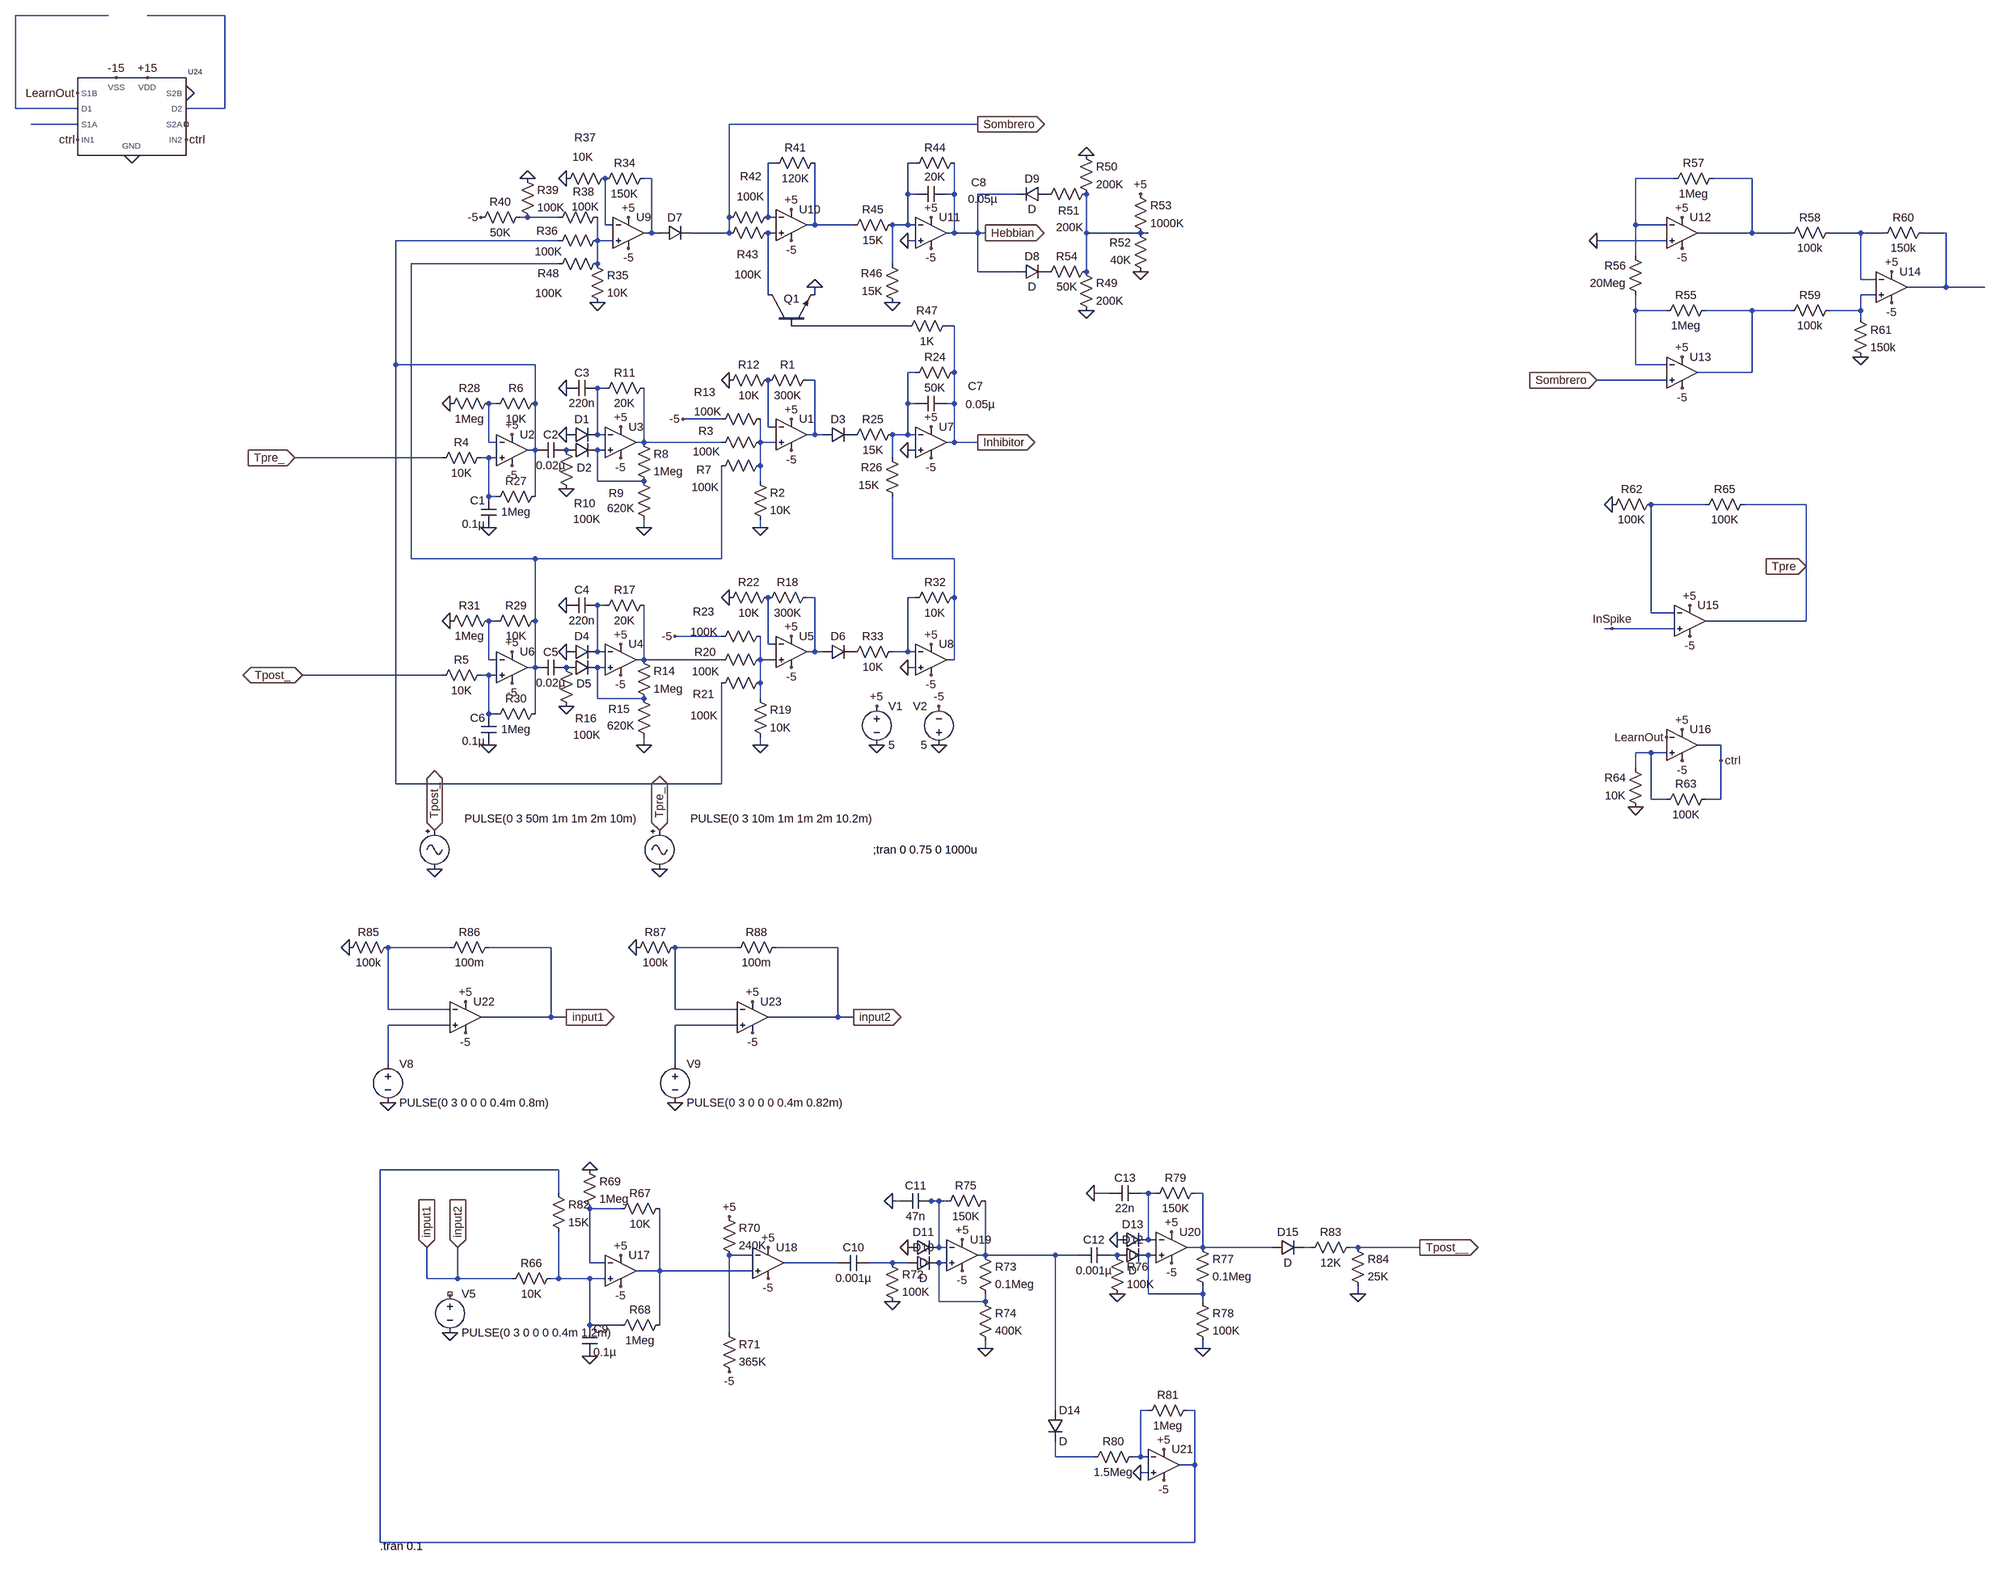
[diagram p0: schematic combined_schematicV3.asc]
combined_schematicV3.asc, the LTspice schematic file:
Version 4
SHEET 1 2820 2808
WIRE -1376 -544 -1568 -544
WIRE -1136 -544 -1296 -544
WIRE -1568 -352 -1568 -544
WIRE -1440 -352 -1568 -352
WIRE -1136 -352 -1136 -544
WIRE -1136 -352 -1216 -352
WIRE -1440 -320 -1536 -320
WIRE 416 -320 -96 -320
WIRE 0 -240 -16 -240
WIRE 288 -240 272 -240
WIRE -256 -208 -272 -208
WIRE 2176 -208 2096 -208
WIRE 2336 -208 2256 -208
WIRE 272 -176 272 -240
WIRE 288 -176 272 -176
WIRE 368 -176 368 -240
WIRE 368 -176 352 -176
WIRE 496 -176 416 -176
WIRE -512 -128 -528 -128
WIRE -448 -128 -512 -128
WIRE -96 -128 -96 -320
WIRE -16 -128 -16 -240
WIRE 0 -128 -16 -128
WIRE -352 -112 -352 -208
WIRE -336 -112 -352 -112
WIRE 80 -112 80 -240
WIRE 80 -112 64 -112
WIRE 160 -112 80 -112
WIRE 272 -112 272 -176
WIRE 272 -112 240 -112
WIRE 288 -112 272 -112
WIRE 2096 -112 2096 -208
WIRE 2160 -112 2096 -112
WIRE -256 -96 -256 -208
WIRE -256 -96 -272 -96
WIRE -240 -96 -256 -96
WIRE -96 -96 -96 -128
WIRE -96 -96 -176 -96
WIRE 0 -96 -16 -96
WIRE 368 -96 368 -176
WIRE 368 -96 352 -96
WIRE 416 -96 416 -176
WIRE 416 -96 368 -96
WIRE 432 -96 416 -96
WIRE 640 -96 640 -176
WIRE 752 -96 640 -96
WIRE 768 -96 752 -96
WIRE 2336 -96 2336 -208
WIRE 2336 -96 2224 -96
WIRE 2416 -96 2336 -96
WIRE 2560 -96 2496 -96
WIRE 2608 -96 2560 -96
WIRE 2736 -96 2688 -96
WIRE -448 -80 -784 -80
WIRE -368 -80 -368 -128
WIRE -336 -80 -368 -80
WIRE 288 -80 272 -80
WIRE 2160 -80 2016 -80
WIRE 2096 -48 2096 -112
WIRE -448 -32 -752 -32
WIRE -368 -32 -368 -80
WIRE 240 -32 240 -112
WIRE 416 -16 416 -96
WIRE 496 -16 416 -16
WIRE 640 -16 640 -96
WIRE 2560 0 2560 -96
WIRE 2592 0 2560 0
WIRE 2736 16 2736 -96
WIRE 2736 16 2656 16
WIRE 2816 16 2736 16
WIRE -16 32 -16 -96
WIRE 80 32 80 16
WIRE 2592 32 2560 32
WIRE 2096 64 2096 32
WIRE 2160 64 2096 64
WIRE 2336 64 2240 64
WIRE 2416 64 2336 64
WIRE 2560 64 2560 32
WIRE 2560 64 2496 64
WIRE 2560 80 2560 64
WIRE 272 96 32 96
WIRE 368 96 352 96
WIRE -784 176 -784 -80
WIRE -496 176 -784 176
WIRE 2096 176 2096 64
WIRE 2160 176 2096 176
WIRE 288 192 272 192
WIRE 368 192 368 96
WIRE 2336 192 2336 64
WIRE 2336 192 2224 192
WIRE 80 208 64 208
WIRE 2160 208 2016 208
WIRE -352 224 -368 224
WIRE -576 256 -592 256
WIRE -496 256 -496 176
WIRE 272 256 272 192
WIRE 288 256 272 256
WIRE 368 256 368 192
WIRE 368 256 352 256
WIRE -112 288 -192 288
WIRE -16 304 -16 208
WIRE 0 304 -16 304
WIRE -368 320 -368 224
WIRE -352 320 -368 320
WIRE 80 320 80 208
WIRE 80 320 64 320
WIRE 96 320 80 320
WIRE 272 320 272 256
WIRE 272 320 240 320
WIRE 288 320 272 320
WIRE -592 336 -592 256
WIRE -576 336 -592 336
WIRE -272 336 -272 224
WIRE -272 336 -288 336
WIRE -112 336 -272 336
WIRE -32 336 -32 288
WIRE 0 336 -32 336
WIRE 368 336 368 256
WIRE 368 336 352 336
WIRE 416 336 368 336
WIRE -496 352 -496 256
WIRE -496 352 -512 352
WIRE -352 352 -368 352
WIRE 288 352 272 352
WIRE -688 368 -992 368
WIRE -592 368 -608 368
WIRE -576 368 -592 368
WIRE 240 368 240 320
WIRE -32 384 -32 336
WIRE -368 416 -368 352
WIRE -272 416 -368 416
WIRE -32 416 -32 384
WIRE -592 448 -592 368
WIRE -576 448 -592 448
WIRE -496 448 -496 352
WIRE 2240 464 2128 464
WIRE 2448 464 2320 464
WIRE -272 512 -272 496
WIRE -32 512 -32 496
WIRE -752 576 -752 -32
WIRE -496 576 -752 576
WIRE -112 576 -112 384
WIRE -112 576 -496 576
WIRE 240 576 240 448
WIRE 368 576 240 576
WIRE 2448 592 2448 464
WIRE 80 656 64 656
WIRE 288 656 272 656
WIRE 368 656 368 576
WIRE -352 672 -368 672
WIRE 2128 688 2128 464
WIRE 2176 688 2128 688
WIRE -576 704 -592 704
WIRE -496 704 -496 576
WIRE 2448 704 2448 592
WIRE 2448 704 2240 704
WIRE 2048 720 2032 720
WIRE 2176 720 2048 720
WIRE -112 736 -208 736
WIRE -16 752 -16 656
WIRE 0 752 -16 752
WIRE -368 768 -368 672
WIRE -352 768 -368 768
WIRE 80 768 80 656
WIRE 80 768 64 768
WIRE 96 768 80 768
WIRE 272 768 272 656
WIRE 272 768 240 768
WIRE 288 768 272 768
WIRE -592 784 -592 704
WIRE -576 784 -592 784
WIRE -272 784 -272 672
WIRE -272 784 -288 784
WIRE -112 784 -272 784
WIRE -32 784 -32 736
WIRE 0 784 -32 784
WIRE 368 784 368 656
WIRE 368 784 352 784
WIRE -496 800 -496 704
WIRE -496 800 -512 800
WIRE -352 800 -368 800
WIRE 288 800 272 800
WIRE -688 816 -976 816
WIRE -592 816 -608 816
WIRE -576 816 -592 816
WIRE -32 832 -32 784
WIRE -368 864 -368 800
WIRE -272 864 -368 864
WIRE -32 864 -32 832
WIRE -592 896 -592 816
WIRE -576 896 -592 896
WIRE -496 896 -496 800
WIRE -272 960 -272 944
WIRE -32 960 -32 944
WIRE 2272 960 2224 960
WIRE 2128 976 2096 976
WIRE 2160 976 2128 976
WIRE 2272 992 2272 960
WIRE 2096 1008 2096 976
WIRE -784 1040 -784 176
WIRE -112 1040 -112 832
WIRE -112 1040 -784 1040
WIRE 2128 1072 2128 976
WIRE 2160 1072 2128 1072
WIRE 2272 1072 2272 992
WIRE 2272 1072 2240 1072
WIRE -672 1504 -800 1504
WIRE -464 1504 -592 1504
WIRE -80 1504 -208 1504
WIRE 128 1504 0 1504
WIRE -800 1632 -800 1504
WIRE -672 1632 -800 1632
WIRE -208 1632 -208 1504
WIRE -80 1632 -208 1632
WIRE -464 1648 -464 1504
WIRE -464 1648 -608 1648
WIRE -432 1648 -464 1648
WIRE 128 1648 128 1504
WIRE 128 1648 -16 1648
WIRE 160 1648 128 1648
WIRE -672 1664 -800 1664
WIRE -80 1664 -208 1664
WIRE -800 1744 -800 1664
WIRE -208 1744 -208 1664
WIRE -448 2016 -816 2016
WIRE -448 2064 -448 2016
WIRE 688 2064 656 2064
WIRE 768 2064 752 2064
WIRE 784 2064 768 2064
WIRE 880 2064 864 2064
WIRE 256 2080 240 2080
WIRE 320 2080 304 2080
WIRE 336 2080 320 2080
WIRE 352 2080 336 2080
WIRE -320 2096 -384 2096
WIRE 768 2160 768 2064
WIRE 784 2160 768 2160
WIRE 336 2176 336 2080
WIRE 352 2176 336 2176
WIRE 880 2176 880 2064
WIRE 880 2176 848 2176
WIRE 1024 2176 880 2176
WIRE 1104 2176 1088 2176
WIRE 1200 2176 1184 2176
WIRE 1328 2176 1200 2176
WIRE -48 2192 -96 2192
WIRE 432 2192 432 2080
WIRE 432 2192 416 2192
WIRE 576 2192 432 2192
WIRE 624 2192 576 2192
WIRE 704 2192 688 2192
WIRE 784 2192 768 2192
WIRE -384 2208 -384 2096
WIRE -352 2208 -384 2208
WIRE 128 2208 16 2208
WIRE 240 2208 192 2208
WIRE 272 2208 240 2208
WIRE 352 2208 336 2208
WIRE -240 2224 -240 2096
WIRE -240 2224 -288 2224
WIRE -48 2224 -240 2224
WIRE -720 2240 -720 2176
WIRE -656 2240 -656 2176
WIRE -656 2240 -720 2240
WIRE -544 2240 -656 2240
WIRE -448 2240 -448 2144
WIRE -448 2240 -464 2240
WIRE -384 2240 -448 2240
WIRE -352 2240 -384 2240
WIRE 768 2272 768 2192
WIRE 880 2272 880 2256
WIRE 880 2272 768 2272
WIRE 1200 2272 1200 2256
WIRE 336 2288 336 2208
WIRE 432 2288 432 2272
WIRE 432 2288 336 2288
WIRE 880 2288 880 2272
WIRE -384 2336 -384 2240
WIRE -320 2336 -384 2336
WIRE -240 2336 -240 2224
WIRE -96 2352 -96 2192
WIRE 432 2384 432 2368
WIRE 880 2384 880 2368
WIRE 576 2512 576 2192
WIRE 768 2512 752 2512
WIRE 864 2512 848 2512
WIRE 576 2608 576 2576
WIRE 656 2608 576 2608
WIRE 752 2608 752 2512
WIRE 752 2608 736 2608
WIRE 768 2608 752 2608
WIRE 864 2624 864 2512
WIRE 864 2624 832 2624
WIRE 768 2640 752 2640
WIRE -816 2784 -816 2016
WIRE 864 2784 864 2624
WIRE 864 2784 -816 2784
FLAG 32 288 +5
FLAG 32 352 -5
FLAG -240 1216 0
FLAG -704 1216 0
FLAG -544 320 +5
FLAG -544 384 -5
FLAG -320 304 +5
FLAG -320 368 -5
FLAG -432 320 0
FLAG -432 224 0
FLAG -432 432 0
FLAG -96 208 0
FLAG -192 288 -5
FLAG -320 752 +5
FLAG -320 816 -5
FLAG -432 768 0
FLAG -432 672 0
FLAG -432 880 0
FLAG -272 960 0
FLAG -272 512 0
FLAG 32 736 +5
FLAG 32 800 -5
FLAG -96 656 0
FLAG -208 736 -5
FLAG -592 512 0
FLAG -672 256 0
FLAG -544 768 +5
FLAG -544 832 -5
FLAG -592 960 0
FLAG -672 704 0
FLAG 320 304 +5
FLAG 320 368 -5
FLAG 320 752 +5
FLAG 320 816 -5
FLAG 272 800 0
FLAG 272 352 0
FLAG -32 512 0
FLAG -32 960 0
FLAG 416 336 Inhibitor
IOPIN 416 336 Out
FLAG -304 -128 +5
FLAG -304 -64 -5
FLAG -432 -208 0
FLAG -512 -208 0
FLAG 32 -144 +5
FLAG 32 -80 -5
FLAG -608 -128 -5
FLAG 320 -128 +5
FLAG 320 -64 -5
FLAG 272 -80 0
FLAG 240 48 0
FLAG 80 16 0
FLAG 416 -320 Sombrero
IOPIN 416 -320 Out
FLAG 208 960 0
FLAG 336 960 0
FLAG 336 880 -5
FLAG 208 880 +5
FLAG -976 816 Tpost_
IOPIN -976 816 BiDir
FLAG -704 1136 Tpost_
IOPIN -704 1136 BiDir
FLAG -240 1136 Tpre_
IOPIN -240 1136 BiDir
FLAG -368 48 0
FLAG -992 368 Tpre_
IOPIN -992 368 In
FLAG 432 -96 Hebbian
IOPIN 432 -96 Out
FLAG 752 -16 0
FLAG 752 -176 +5
FLAG 640 -256 0
FLAG 640 64 0
FLAG 2192 -128 +5
FLAG 2192 -64 -5
FLAG 2192 160 +5
FLAG 2192 224 -5
FLAG 2624 -16 +5
FLAG 2624 48 -5
FLAG 2560 160 0
FLAG 2016 208 Sombrero
IOPIN 2016 208 In
FLAG 2016 -80 0
FLAG 2208 672 +5
FLAG 2208 736 -5
FLAG 2048 720 InSpike
FLAG 2048 464 0
FLAG 2448 592 Tpre
IOPIN 2448 592 In
FLAG 2192 928 +5
FLAG 2160 944 LearnOut
FLAG 2096 1088 0
FLAG 2272 992 ctrl
FLAG 2192 992 -5
FLAG -1328 -256 0
FLAG -1296 -416 +15
FLAG -1360 -416 -15
FLAG -1216 -384 0
FLAG -1440 -384 LearnOut
FLAG -1440 -288 ctrl
FLAG -1216 -288 ctrl
FLAG -384 2016 0
FLAG -384 2400 0
FLAG 240 2288 0
FLAG 432 2384 0
FLAG 240 2080 0
FLAG 272 2176 0
FLAG 704 2272 0
FLAG 880 2384 0
FLAG 656 2064 0
FLAG 704 2160 0
FLAG 752 2640 0
FLAG -672 2352 0
FLAG -320 2192 +5
FLAG -16 2176 +5
FLAG 384 2160 +5
FLAG 816 2144 +5
FLAG 800 2592 +5
FLAG 1200 2272 0
FLAG 1328 2176 Tpost__
IOPIN 1328 2176 Out
FLAG -16 2240 -5
FLAG -320 2256 -5
FLAG 384 2224 -5
FLAG 816 2208 -5
FLAG 800 2656 -5
FLAG -96 2432 -5
FLAG -96 2112 +5
FLAG -880 1504 0
FLAG -800 1824 0
FLAG -640 1616 +5
FLAG -640 1680 -5
FLAG -288 1504 0
FLAG -208 1824 0
FLAG -48 1616 +5
FLAG -48 1680 -5
FLAG -432 1648 input1
IOPIN -432 1648 Out
FLAG 160 1648 input2
IOPIN 160 1648 Out
FLAG -720 2176 input1
IOPIN -720 2176 In
FLAG -656 2176 input2
IOPIN -656 2176 In
SYMBOL Opamps\\UniversalOpamp2 32 320 R0
SYMATTR InstName U1
SYMBOL res 80 192 R90
WINDOW 0 0 56 VBottom 2
WINDOW 3 32 56 VTop 2
SYMATTR InstName R1
SYMATTR Value 300K
SYMBOL res -48 400 R0
SYMATTR InstName R2
SYMATTR Value 10K
SYMBOL res -16 320 R90
WINDOW 0 8 128 VBottom 2
WINDOW 3 20 127 VTop 2
SYMATTR InstName R3
SYMATTR Value 100K
SYMBOL Opamps\\UniversalOpamp2 -544 352 R0
SYMATTR InstName U2
SYMBOL cap -576 512 R180
WINDOW 0 24 56 Left 2
WINDOW 3 24 8 Left 2
SYMATTR InstName C1
SYMATTR Value 0.1µ
SYMBOL res -592 352 R90
WINDOW 0 0 56 VBottom 2
WINDOW 3 32 56 VTop 2
SYMATTR InstName R4
SYMATTR Value 10K
SYMBOL res -592 800 R90
WINDOW 0 0 56 VBottom 2
WINDOW 3 32 56 VTop 2
SYMATTR InstName R5
SYMATTR Value 10K
SYMBOL res -480 240 R90
WINDOW 0 0 56 VBottom 2
WINDOW 3 32 56 VTop 2
SYMATTR InstName R6
SYMATTR Value 10K
SYMBOL res -16 368 R90
WINDOW 0 40 132 VBottom 2
WINDOW 3 45 130 VTop 2
SYMATTR InstName R7
SYMATTR Value 100K
SYMBOL Opamps\\UniversalOpamp2 -320 336 R0
SYMATTR InstName U3
SYMBOL diode -432 336 R270
WINDOW 0 32 32 VTop 2
WINDOW 3 0 32 Invisible 2
SYMATTR InstName D1
SYMBOL diode -432 368 R270
WINDOW 0 -36 37 VTop 2
WINDOW 3 0 32 Invisible 2
SYMATTR InstName D2
SYMBOL res -288 320 R0
SYMATTR InstName R8
SYMATTR Value 1Meg
SYMBOL res -256 512 R180
WINDOW 0 58 71 Left 2
WINDOW 3 36 40 Left 2
SYMATTR InstName R9
SYMATTR Value 620K
SYMBOL res -448 336 R0
WINDOW 0 32 126 Left 2
WINDOW 3 30 158 Left 2
SYMATTR InstName R10
SYMATTR Value 100K
SYMBOL cap -432 336 R90
WINDOW 0 0 32 VBottom 2
WINDOW 3 32 32 VTop 2
SYMATTR InstName C2
SYMATTR Value 0.02µ
SYMBOL res -256 208 R90
WINDOW 0 0 56 VBottom 2
WINDOW 3 32 56 VTop 2
SYMATTR InstName R11
SYMATTR Value 20K
SYMBOL cap -368 208 R90
WINDOW 0 0 32 VBottom 2
WINDOW 3 32 32 VTop 2
SYMATTR InstName C3
SYMATTR Value 220n
SYMBOL res -112 224 R270
WINDOW 0 32 56 VTop 2
WINDOW 3 0 56 VBottom 2
SYMATTR InstName R12
SYMATTR Value 10K
SYMBOL diode 96 336 R270
WINDOW 0 32 32 VTop 2
WINDOW 3 0 32 Invisible 2
SYMATTR InstName D3
SYMBOL res -16 272 R90
WINDOW 0 -24 131 VBottom 2
WINDOW 3 -15 125 VTop 2
SYMATTR InstName R13
SYMATTR Value 100K
SYMBOL Opamps\\UniversalOpamp2 -320 784 R0
SYMATTR InstName U4
SYMBOL diode -432 784 R270
WINDOW 0 32 32 VTop 2
WINDOW 3 0 32 Invisible 2
SYMATTR InstName D4
SYMBOL diode -432 816 R270
WINDOW 0 -33 36 VTop 2
WINDOW 3 0 32 Invisible 2
SYMATTR InstName D5
SYMBOL res -288 768 R0
SYMATTR InstName R14
SYMATTR Value 1Meg
SYMBOL res -256 960 R180
WINDOW 0 45 74 Left 2
WINDOW 3 36 40 Left 2
SYMATTR InstName R15
SYMATTR Value 620K
SYMBOL res -448 784 R0
WINDOW 0 34 121 Left 2
WINDOW 3 30 155 Left 2
SYMATTR InstName R16
SYMATTR Value 100K
SYMBOL res -256 656 R90
WINDOW 0 0 56 VBottom 2
WINDOW 3 32 56 VTop 2
SYMATTR InstName R17
SYMATTR Value 20K
SYMBOL cap -368 656 R90
WINDOW 0 0 32 VBottom 2
WINDOW 3 32 32 VTop 2
SYMATTR InstName C4
SYMATTR Value 220n
SYMBOL cap -432 784 R90
WINDOW 0 0 32 VBottom 2
WINDOW 3 32 32 VTop 2
SYMATTR InstName C5
SYMATTR Value 0.02µ
SYMBOL Opamps\\UniversalOpamp2 32 768 R0
SYMATTR InstName U5
SYMBOL res 80 640 R90
WINDOW 0 0 56 VBottom 2
WINDOW 3 32 56 VTop 2
SYMATTR InstName R18
SYMATTR Value 300K
SYMBOL res -48 848 R0
SYMATTR InstName R19
SYMATTR Value 10K
SYMBOL res -16 768 R90
WINDOW 0 16 130 VBottom 2
WINDOW 3 25 129 VTop 2
SYMATTR InstName R20
SYMATTR Value 100K
SYMBOL res -16 816 R90
WINDOW 0 55 133 VBottom 2
WINDOW 3 68 132 VTop 2
SYMATTR InstName R21
SYMATTR Value 100K
SYMBOL res -112 672 R270
WINDOW 0 32 56 VTop 2
WINDOW 3 0 56 VBottom 2
SYMATTR InstName R22
SYMATTR Value 10K
SYMBOL diode 96 784 R270
WINDOW 0 32 32 VTop 2
WINDOW 3 0 32 Invisible 2
SYMATTR InstName D6
SYMBOL res -16 720 R90
WINDOW 0 -19 133 VBottom 2
WINDOW 3 -9 132 VTop 2
SYMATTR InstName R23
SYMATTR Value 100K
SYMBOL res 384 176 R90
WINDOW 0 0 56 VBottom 2
WINDOW 3 32 56 VTop 2
SYMATTR InstName R24
SYMATTR Value 50K
SYMBOL res 256 304 R90
WINDOW 0 0 56 VBottom 2
WINDOW 3 32 56 VTop 2
SYMATTR InstName R25
SYMATTR Value 15K
SYMBOL res 256 464 R180
WINDOW 0 36 76 Left 2
WINDOW 3 43 40 Left 2
SYMATTR InstName R26
SYMATTR Value 15K
SYMBOL res -480 432 R90
WINDOW 0 0 56 VBottom 2
WINDOW 3 32 56 VTop 2
SYMATTR InstName R27
SYMATTR Value 1Meg
SYMBOL res -576 240 R90
WINDOW 0 0 56 VBottom 2
WINDOW 3 32 56 VTop 2
SYMATTR InstName R28
SYMATTR Value 1Meg
SYMBOL Opamps\\UniversalOpamp2 -544 800 R0
SYMATTR InstName U6
SYMBOL cap -576 960 R180
WINDOW 0 24 56 Left 2
WINDOW 3 24 8 Left 2
SYMATTR InstName C6
SYMATTR Value 0.1µ
SYMBOL res -480 688 R90
WINDOW 0 0 56 VBottom 2
WINDOW 3 32 56 VTop 2
SYMATTR InstName R29
SYMATTR Value 10K
SYMBOL res -480 880 R90
WINDOW 0 0 56 VBottom 2
WINDOW 3 32 56 VTop 2
SYMATTR InstName R30
SYMATTR Value 1Meg
SYMBOL res -576 688 R90
WINDOW 0 0 56 VBottom 2
WINDOW 3 32 56 VTop 2
SYMATTR InstName R31
SYMATTR Value 1Meg
SYMBOL Opamps\\UniversalOpamp2 320 336 R0
SYMATTR InstName U7
SYMBOL res 384 640 R90
WINDOW 0 0 56 VBottom 2
WINDOW 3 32 56 VTop 2
SYMATTR InstName R32
SYMATTR Value 10K
SYMBOL Opamps\\UniversalOpamp2 320 784 R0
SYMATTR InstName U8
SYMBOL res 256 752 R90
WINDOW 0 0 56 VBottom 2
WINDOW 3 32 56 VTop 2
SYMATTR InstName R33
SYMATTR Value 10K
SYMBOL cap 352 240 R90
WINDOW 0 -4 -60 VBottom 2
WINDOW 3 2 -70 VTop 2
SYMATTR InstName C7
SYMATTR Value 0.05µ
SYMBOL Opamps\\UniversalOpamp2 -304 -96 R0
SYMATTR InstName U9
SYMBOL res -256 -224 R90
WINDOW 0 0 56 VBottom 2
WINDOW 3 32 56 VTop 2
SYMATTR InstName R34
SYMATTR Value 150K
SYMBOL res -384 -48 R0
SYMATTR InstName R35
SYMATTR Value 10K
SYMBOL res -352 -96 R90
WINDOW 0 12 120 VBottom 2
WINDOW 3 23 117 VTop 2
SYMATTR InstName R36
SYMATTR Value 100K
SYMBOL res -448 -192 R270
WINDOW 0 85 55 VTop 2
WINDOW 3 76 50 VBottom 2
SYMATTR InstName R37
SYMATTR Value 10K
SYMBOL res -352 -144 R90
WINDOW 0 -21 45 VBottom 2
WINDOW 3 -21 41 VTop 2
SYMATTR InstName R38
SYMATTR Value 100K
SYMBOL res -528 -224 R0
SYMATTR InstName R39
SYMATTR Value 100K
SYMBOL res -512 -144 R90
WINDOW 0 0 56 VBottom 2
WINDOW 3 32 56 VTop 2
SYMATTR InstName R40
SYMATTR Value 50K
SYMBOL diode -240 -80 R270
WINDOW 0 32 32 VTop 2
WINDOW 3 0 32 Invisible 2
SYMATTR InstName D7
SYMBOL res 96 -256 R90
WINDOW 0 0 56 VBottom 2
WINDOW 3 32 56 VTop 2
SYMATTR InstName R41
SYMATTR Value 120K
SYMBOL Opamps\\UniversalOpamp2 32 -112 R0
SYMATTR InstName U10
SYMBOL res 0 -144 R90
WINDOW 0 -53 52 VBottom 2
WINDOW 3 -42 52 VTop 2
SYMATTR InstName R42
SYMATTR Value 100K
SYMBOL res 0 -112 R90
WINDOW 0 76 58 VBottom 2
WINDOW 3 87 57 VTop 2
SYMATTR InstName R43
SYMATTR Value 100K
SYMBOL npn -16 96 R270
WINDOW 0 56 32 VRight 2
WINDOW 3 56 68 Invisible 2
SYMATTR InstName Q1
SYMBOL res 384 -256 R90
WINDOW 0 0 56 VBottom 2
WINDOW 3 60 56 VBottom 2
SYMATTR InstName R44
SYMATTR Value 20K
SYMBOL res 256 -128 R90
WINDOW 0 0 56 VBottom 2
WINDOW 3 32 56 VTop 2
SYMATTR InstName R45
SYMATTR Value 15K
SYMBOL res 256 64 R180
WINDOW 0 36 76 Left 2
WINDOW 3 36 40 Left 2
SYMATTR InstName R46
SYMATTR Value 15K
SYMBOL Opamps\\UniversalOpamp2 320 -96 R0
SYMATTR InstName U11
SYMBOL cap 352 -192 R90
WINDOW 0 8 -66 VBottom 2
WINDOW 3 11 -75 VTop 2
SYMATTR InstName C8
SYMATTR Value 0.05µ
SYMBOL res 256 112 R270
WINDOW 0 32 56 VTop 2
WINDOW 3 0 56 VBottom 2
SYMATTR InstName R47
SYMATTR Value 1K
SYMBOL voltage 208 864 R0
WINDOW 123 0 0 Left 2
WINDOW 39 0 0 Left 2
SYMATTR InstName V1
SYMATTR Value 5
SYMBOL voltage 336 976 R180
WINDOW 0 24 96 Left 2
WINDOW 3 24 16 Left 2
WINDOW 123 0 0 Left 2
WINDOW 39 0 0 Left 2
SYMATTR InstName V2
SYMATTR Value 5
SYMBOL Misc\\signal -704 1120 R0
WINDOW 0 24 16 Invisible 2
WINDOW 3 62 -8 Left 2
WINDOW 123 0 0 Left 2
WINDOW 39 0 0 Left 2
SYMATTR InstName V3
SYMATTR Value PULSE(0 3 50m 1m 1m 2m 10m)
SYMBOL Misc\\signal -240 1120 R0
WINDOW 0 24 16 Invisible 2
WINDOW 3 64 -8 Left 2
WINDOW 123 0 0 Left 2
WINDOW 39 0 0 Left 2
SYMATTR InstName V4
SYMATTR Value PULSE(0 3 10m 1m 1m 2m 10.2m)
SYMBOL res -352 -48 R90
WINDOW 0 51 117 VBottom 2
WINDOW 3 61 116 VTop 2
SYMATTR InstName R48
SYMATTR Value 100K
SYMBOL diode 496 0 R270
WINDOW 0 32 32 VTop 2
WINDOW 3 0 32 VBottom 2
SYMATTR InstName D8
SYMBOL diode 560 -192 R90
WINDOW 0 0 32 VBottom 2
WINDOW 3 32 32 VTop 2
SYMATTR InstName D9
SYMBOL res 624 -32 R0
SYMATTR InstName R49
SYMATTR Value 200K
SYMBOL res 624 -272 R0
SYMATTR InstName R50
SYMATTR Value 200K
SYMBOL res 656 -192 R90
WINDOW 0 66 52 VBottom 2
WINDOW 3 69 50 VTop 2
SYMATTR InstName R51
SYMATTR Value 200K
SYMBOL res 768 0 R180
WINDOW 0 36 76 Left 2
WINDOW 3 36 40 Left 2
SYMATTR InstName R52
SYMATTR Value 40K
SYMBOL res 736 -192 R0
SYMATTR InstName R53
SYMATTR Value 1000K
SYMBOL res 656 -32 R90
WINDOW 0 0 56 VBottom 2
WINDOW 3 32 56 VTop 2
SYMATTR InstName R54
SYMATTR Value 50K
SYMBOL Opamps\\UniversalOpamp2 2192 -96 R0
SYMATTR InstName U12
SYMBOL Opamps\\UniversalOpamp2 2192 192 R0
SYMATTR InstName U13
SYMBOL res 2256 48 R90
WINDOW 0 0 56 VBottom 2
WINDOW 3 32 56 VTop 2
SYMATTR InstName R55
SYMATTR Value 1Meg
SYMBOL res 2112 48 R180
WINDOW 0 36 76 Left 2
WINDOW 3 36 40 Left 2
SYMATTR InstName R56
SYMATTR Value 20Meg
SYMBOL res 2160 -192 R270
WINDOW 0 32 56 VTop 2
WINDOW 3 0 56 VBottom 2
SYMATTR InstName R57
SYMATTR Value 1Meg
SYMBOL res 2512 -112 R90
WINDOW 0 0 56 VBottom 2
WINDOW 3 32 56 VTop 2
SYMATTR InstName R58
SYMATTR Value 100k
SYMBOL res 2512 48 R90
WINDOW 0 0 56 VBottom 2
WINDOW 3 32 56 VTop 2
SYMATTR InstName R59
SYMATTR Value 100k
SYMBOL Opamps\\UniversalOpamp2 2624 16 R0
SYMATTR InstName U14
SYMBOL res 2704 -112 R90
WINDOW 0 0 56 VBottom 2
WINDOW 3 32 56 VTop 2
SYMATTR InstName R60
SYMATTR Value 150k
SYMBOL res 2544 64 R0
SYMATTR InstName R61
SYMATTR Value 150k
SYMBOL Opamps\\UniversalOpamp2 2208 704 R0
SYMATTR InstName U15
SYMBOL res 2144 448 R90
WINDOW 0 0 56 VBottom 2
WINDOW 3 32 56 VTop 2
SYMATTR InstName R62
SYMATTR Value 100K
SYMBOL Opamps\\UniversalOpamp2 2192 960 R0
SYMATTR InstName U16
SYMBOL res 2256 1056 R90
WINDOW 0 0 56 VBottom 2
WINDOW 3 32 56 VTop 2
SYMATTR InstName R63
SYMATTR Value 100K
SYMBOL res 2112 1104 R180
WINDOW 0 36 76 Left 2
WINDOW 3 36 40 Left 2
SYMATTR InstName R64
SYMATTR Value 10K
SYMBOL res 2336 448 R90
WINDOW 0 0 56 VBottom 2
WINDOW 3 32 56 VTop 2
SYMATTR InstName R65
SYMATTR Value 100K
SYMBOL voltage -672 2256 R0
WINDOW 123 0 0 Left 0
WINDOW 39 0 0 Left 0
SYMATTR InstName V5
SYMATTR Value PULSE(0 3 0 0 0 0.4m 1.2m)
SYMBOL res -448 2224 R90
WINDOW 0 0 56 VBottom 2
WINDOW 3 32 56 VTop 2
SYMATTR InstName R66
SYMATTR Value 10K
SYMBOL Opamps\\UniversalOpamp2 -320 2224 R0
SYMATTR InstName U17
SYMBOL res -224 2080 R90
WINDOW 0 0 56 VBottom 2
WINDOW 3 32 56 VTop 2
SYMATTR InstName R67
SYMATTR Value 10K
SYMBOL res -224 2320 R90
WINDOW 0 0 56 VBottom 2
WINDOW 3 32 56 VTop 2
SYMATTR InstName R68
SYMATTR Value 1Meg
SYMBOL res -400 2000 R0
SYMATTR InstName R69
SYMATTR Value 1Meg
SYMBOL cap -400 2336 R0
SYMATTR InstName C9
SYMATTR Value 0.1µ
SYMBOL Opamps\\UniversalOpamp2 -16 2208 R0
SYMATTR InstName U18
SYMBOL res -112 2096 R0
SYMATTR InstName R70
SYMATTR Value 240K
SYMBOL res -112 2336 R0
SYMATTR InstName R71
SYMATTR Value 365K
SYMBOL cap 192 2192 R90
WINDOW 0 0 32 VBottom 2
WINDOW 3 32 32 VTop 2
SYMATTR InstName C10
SYMATTR Value 0.001µ
SYMBOL res 224 2192 R0
SYMATTR InstName R72
SYMATTR Value 100K
SYMBOL diode 272 2224 R270
WINDOW 0 32 32 VTop 2
WINDOW 3 0 32 VBottom 2
SYMATTR InstName D10
SYMBOL Opamps\\UniversalOpamp2 384 2192 R0
SYMATTR InstName U19
SYMBOL res 416 2176 R0
SYMATTR InstName R73
SYMATTR Value 0.1Meg
SYMBOL res 416 2272 R0
SYMATTR InstName R74
SYMATTR Value 400K
SYMBOL res 448 2064 R90
WINDOW 0 0 56 VBottom 2
WINDOW 3 32 56 VTop 2
SYMATTR InstName R75
SYMATTR Value 150K
SYMBOL cap 320 2064 R90
WINDOW 0 0 32 VBottom 2
WINDOW 3 32 32 VTop 2
SYMATTR InstName C11
SYMATTR Value 47n
SYMBOL diode 272 2192 R270
WINDOW 0 32 32 VTop 2
WINDOW 3 0 32 VBottom 2
SYMATTR InstName D11
SYMBOL cap 688 2176 R90
WINDOW 0 0 32 VBottom 2
WINDOW 3 32 32 VTop 2
SYMATTR InstName C12
SYMATTR Value 0.001µ
SYMBOL diode 704 2208 R270
WINDOW 0 32 32 VTop 2
WINDOW 3 0 32 VBottom 2
SYMATTR InstName D12
SYMBOL res 688 2176 R0
SYMATTR InstName R76
SYMATTR Value 100K
SYMBOL Opamps\\UniversalOpamp2 816 2176 R0
SYMATTR InstName U20
SYMBOL res 864 2160 R0
SYMATTR InstName R77
SYMATTR Value 0.1Meg
SYMBOL res 864 2272 R0
SYMATTR InstName R78
SYMATTR Value 100K
SYMBOL res 880 2048 R90
WINDOW 0 0 56 VBottom 2
WINDOW 3 32 56 VTop 2
SYMATTR InstName R79
SYMATTR Value 150K
SYMBOL cap 752 2048 R90
WINDOW 0 0 32 VBottom 2
WINDOW 3 32 32 VTop 2
SYMATTR InstName C13
SYMATTR Value 22n
SYMBOL diode 704 2176 R270
WINDOW 0 32 32 VTop 2
WINDOW 3 0 32 VBottom 2
SYMATTR InstName D13
SYMBOL diode 560 2512 R0
SYMATTR InstName D14
SYMBOL res 752 2592 R90
WINDOW 0 0 56 VBottom 2
WINDOW 3 32 56 VTop 2
SYMATTR InstName R80
SYMATTR Value 1.5Meg
SYMBOL Opamps\\UniversalOpamp2 800 2624 R0
SYMATTR InstName U21
SYMBOL res 864 2496 R90
WINDOW 0 0 56 VBottom 2
WINDOW 3 32 56 VTop 2
SYMATTR InstName R81
SYMATTR Value 1Meg
SYMBOL res -464 2048 R0
SYMATTR InstName R82
SYMATTR Value 15K
SYMBOL diode 1024 2192 R270
WINDOW 0 32 32 VTop 2
WINDOW 3 0 32 VBottom 2
SYMATTR InstName D15
SYMBOL res 1200 2160 R90
WINDOW 0 0 56 VBottom 2
WINDOW 3 32 56 VTop 2
SYMATTR InstName R83
SYMATTR Value 12K
SYMBOL res 1184 2160 R0
SYMATTR InstName R84
SYMATTR Value 25K
SYMBOL voltage -800 1728 R0
WINDOW 123 0 0 Left 0
WINDOW 39 0 0 Left 0
SYMATTR InstName V8
SYMATTR Value PULSE(0 3 0 0 0 0.4m 0.8m)
SYMBOL Opamps\\UniversalOpamp2 -640 1648 R0
SYMATTR InstName U22
SYMBOL res -784 1488 R90
WINDOW 0 0 56 VBottom 2
WINDOW 3 32 56 VTop 2
SYMATTR InstName R85
SYMATTR Value 100k
SYMBOL res -576 1488 R90
WINDOW 0 0 56 VBottom 2
WINDOW 3 32 56 VTop 2
SYMATTR InstName R86
SYMATTR Value 100m
SYMBOL voltage -208 1728 R0
WINDOW 123 0 0 Left 0
WINDOW 39 0 0 Left 0
SYMATTR InstName V9
SYMATTR Value PULSE(0 3 0 0 0 0.4m 0.82m)
SYMBOL Opamps\\UniversalOpamp2 -48 1648 R0
SYMATTR InstName U23
SYMBOL res -192 1488 R90
WINDOW 0 0 56 VBottom 2
WINDOW 3 32 56 VTop 2
SYMATTR InstName R87
SYMATTR Value 100k
SYMBOL res 16 1488 R90
WINDOW 0 0 56 VBottom 2
WINDOW 3 32 56 VTop 2
SYMATTR InstName R88
SYMATTR Value 100m
SYMBOL ADG1236 -1328 -336 R0
SYMATTR InstName U24
TEXT 200 1176 Left 2 !;tran 0 0.75 0 1000u
TEXT -816 2792 Left 2 !.tran 0.1

The netlist it stands for:
* combined_schematicV3.asc
XU1 N029 N027 +5 -5 N024 level.2 Avol=1Meg GBW=10Meg Slew=10Meg ilimit=25m rail=0 Vos=0 phimargin=45 en=0 enk=0 in=0 ink=0 Rin=500Meg  ; pins IN+ IN- V+ V- OUT
R1 N024 N027 300K
R2 N029 0 10K
R3 N029 N028 100K
XU2 N031 N026 +5 -5 N016 level.2 Avol=1Meg GBW=10Meg Slew=10Meg ilimit=25m rail=0 Vos=0 phimargin=45 en=0 enk=0 in=0 ink=0 Rin=500Meg  ; pins IN+ IN- V+ V- OUT
C1 0 N031 0.1µ
R4 N031 Tpre_ 10K
R5 N042 Tpost_ 10K
R6 N016 N026 10K
R7 N029 N018 100K
XU3 N030 N025 +5 -5 N028 level.2 Avol=1Meg GBW=10Meg Slew=10Meg ilimit=25m rail=0 Vos=0 phimargin=45 en=0 enk=0 in=0 ink=0 Rin=500Meg  ; pins IN+ IN- V+ V- OUT
D1 0 N025 D
D2 P001 N030 D
R8 N028 N030 1Meg
R9 0 N030 620K
R10 P001 0 100K
C2 P001 N016 0.02µ
R11 N028 N025 20K
C3 N025 0 220n
R12 0 N027 10K
D3 N024 P002 D
R13 N029 -5 100K
XU4 N041 N036 +5 -5 N039 level.2 Avol=1Meg GBW=10Meg Slew=10Meg ilimit=25m rail=0 Vos=0 phimargin=45 en=0 enk=0 in=0 ink=0 Rin=500Meg  ; pins IN+ IN- V+ V- OUT
D4 0 N036 D
D5 P003 N041 D
R14 N039 N041 1Meg
R15 0 N041 620K
R16 P003 0 100K
R17 N039 N036 20K
C4 N036 0 220n
C5 P003 N018 0.02µ
XU5 N040 N038 +5 -5 N034 level.2 Avol=1Meg GBW=10Meg Slew=10Meg ilimit=25m rail=0 Vos=0 phimargin=45 en=0 enk=0 in=0 ink=0 Rin=500Meg  ; pins IN+ IN- V+ V- OUT
R18 N034 N038 300K
R19 N040 0 10K
R20 N040 N039 100K
R21 N040 N016 100K
R22 0 N038 10K
D6 N034 P004 D
R23 N040 -5 100K
R24 Inhibitor N023 50K
R25 N023 P002 15K
R26 N033 N023 15K
R27 N016 N031 1Meg
R28 N026 0 1Meg
XU6 N042 N037 +5 -5 N018 level.2 Avol=1Meg GBW=10Meg Slew=10Meg ilimit=25m rail=0 Vos=0 phimargin=45 en=0 enk=0 in=0 ink=0 Rin=500Meg  ; pins IN+ IN- V+ V- OUT
C6 0 N042 0.1µ
R29 N018 N037 10K
R30 N018 N042 1Meg
R31 N037 0 1Meg
XU7 0 N023 +5 -5 Inhibitor level.2 Avol=1Meg GBW=10Meg Slew=10Meg ilimit=25m rail=0 Vos=0 phimargin=45 en=0 enk=0 in=0 ink=0 Rin=500Meg  ; pins IN+ IN- V+ V- OUT
R32 N033 N035 10K
XU8 0 N035 +5 -5 N033 level.2 Avol=1Meg GBW=10Meg Slew=10Meg ilimit=25m rail=0 Vos=0 phimargin=45 en=0 enk=0 in=0 ink=0 Rin=500Meg  ; pins IN+ IN- V+ V- OUT
R33 N035 P004 10K
C7 Inhibitor N023 0.05µ
XU9 N017 N010 +5 -5 N006 level.2 Avol=1Meg GBW=10Meg Slew=10Meg ilimit=25m rail=0 Vos=0 phimargin=45 en=0 enk=0 in=0 ink=0 Rin=500Meg  ; pins IN+ IN- V+ V- OUT
R34 N006 N010 150K
R35 N017 0 10K
R36 N017 N016 100K
R37 0 N010 10K
R38 N017 N009 100K
R39 0 N009 100K
R40 N009 -5 50K
D7 N006 Sombrero D
R41 N011 N004 120K
XU10 N012 N004 +5 -5 N011 level.2 Avol=1Meg GBW=10Meg Slew=10Meg ilimit=25m rail=0 Vos=0 phimargin=45 en=0 enk=0 in=0 ink=0 Rin=500Meg  ; pins IN+ IN- V+ V- OUT
R42 N004 Sombrero 100K
R43 N012 Sombrero 100K
Q1 N012 N022 0 0 NPN
R44 Hebbian N005 20K
R45 N005 N011 15K
R46 0 N005 15K
XU11 0 N005 +5 -5 Hebbian level.2 Avol=1Meg GBW=10Meg Slew=10Meg ilimit=25m rail=0 Vos=0 phimargin=45 en=0 enk=0 in=0 ink=0 Rin=500Meg  ; pins IN+ IN- V+ V- OUT
C8 Hebbian N005 0.05µ
R47 N022 Inhibitor 1K
V1 +5 0 5
V2 0 -5 5
V3 Tpost_ 0 PULSE(0 3 50m 1m 1m 2m 10m)
V4 Tpre_ 0 PULSE(0 3 10m 1m 1m 2m 10.2m)
R48 N017 N018 100K
D8 Hebbian P005 D
D9 P006 Hebbian D
R49 N013 0 200K
R50 0 N013 200K
R51 N013 P006 200K
R52 0 N013 40K
R53 +5 N013 1000K
R54 N013 P005 50K
XU12 0 N007 +5 -5 N008 level.2 Avol=1Meg GBW=10Meg Slew=10Meg ilimit=25m rail=0 Vos=0 phimargin=45 en=0 enk=0 in=0 ink=0 Rin=500Meg  ; pins IN+ IN- V+ V- OUT
XU13 Sombrero N020 +5 -5 N021 level.2 Avol=1Meg GBW=10Meg Slew=10Meg ilimit=25m rail=0 Vos=0 phimargin=45 en=0 enk=0 in=0 ink=0 Rin=500Meg  ; pins IN+ IN- V+ V- OUT
R55 N021 N020 1Meg
R56 N020 N007 20Meg
R57 N007 N008 1Meg
R58 N014 N008 100k
R59 N019 N021 100k
XU14 N019 N014 +5 -5 N015 level.2 Avol=1Meg GBW=10Meg Slew=10Meg ilimit=25m rail=0 Vos=0 phimargin=45 en=0 enk=0 in=0 ink=0 Rin=500Meg  ; pins IN+ IN- V+ V- OUT
R60 N015 N014 150k
R61 N019 0 150k
XU15 InSpike N032 +5 -5 Tpre level.2 Avol=1Meg GBW=10Meg Slew=10Meg ilimit=25m rail=0 Vos=0 phimargin=45 en=0 enk=0 in=0 ink=0 Rin=500Meg  ; pins IN+ IN- V+ V- OUT
R62 N032 0 100K
XU16 N043 LearnOut +5 -5 ctrl level.2 Avol=1Meg GBW=10Meg Slew=10Meg ilimit=25m rail=0 Vos=0 phimargin=45 en=0 enk=0 in=0 ink=0 Rin=500Meg  ; pins IN+ IN- V+ V- OUT
R63 ctrl N043 100K
R64 0 N043 10K
R65 Tpre N032 100K
V5 NC_01 0 PULSE(0 3 0 0 0 0.4m 1.2m)
R66 N062 input2 10K
XU17 N062 N052 +5 -5 N061 level.2 Avol=1Meg GBW=10Meg Slew=10Meg ilimit=25m rail=0 Vos=0 phimargin=45 en=0 enk=0 in=0 ink=0 Rin=500Meg  ; pins IN+ IN- V+ V- OUT
R67 N061 N052 10K
R68 N061 N062 1Meg
R69 0 N052 1Meg
C9 N062 0 0.1µ
XU18 N061 N054 +5 -5 N058 level.2 Avol=1Meg GBW=10Meg Slew=10Meg ilimit=25m rail=0 Vos=0 phimargin=45 en=0 enk=0 in=0 ink=0 Rin=500Meg  ; pins IN+ IN- V+ V- OUT
R70 +5 N054 240K
R71 N054 -5 365K
C10 N059 N058 0.001µ
R72 N059 0 100K
D10 N059 N060 D
XU19 N060 N051 +5 -5 N055 level.2 Avol=1Meg GBW=10Meg Slew=10Meg ilimit=25m rail=0 Vos=0 phimargin=45 en=0 enk=0 in=0 ink=0 Rin=500Meg  ; pins IN+ IN- V+ V- OUT
R73 N055 N060 0.1Meg
R74 N060 0 400K
R75 N055 N051 150K
C11 N051 0 47n
D11 0 N051 D
C12 N056 N055 0.001µ
D12 N056 N057 D
R76 N056 0 100K
XU20 N057 N049 +5 -5 N050 level.2 Avol=1Meg GBW=10Meg Slew=10Meg ilimit=25m rail=0 Vos=0 phimargin=45 en=0 enk=0 in=0 ink=0 Rin=500Meg  ; pins IN+ IN- V+ V- OUT
R77 N050 N057 0.1Meg
R78 N057 0 100K
R79 N050 N049 150K
C13 N049 0 22n
D13 0 N049 D
D14 N055 N064 D
R80 N063 N064 1.5Meg
XU21 0 N063 +5 -5 N048 level.2 Avol=1Meg GBW=10Meg Slew=10Meg ilimit=25m rail=0 Vos=0 phimargin=45 en=0 enk=0 in=0 ink=0 Rin=500Meg  ; pins IN+ IN- V+ V- OUT
R81 N048 N063 1Meg
R82 N048 N062 15K
D15 N050 N053 D
R83 Tpost__ N053 12K
R84 Tpost__ 0 25K
V8 N046 0 PULSE(0 3 0 0 0 0.4m 0.8m)
XU22 N046 N044 +5 -5 input2 level.2 Avol=1Meg GBW=10Meg Slew=10Meg ilimit=25m rail=0 Vos=0 phimargin=45 en=0 enk=0 in=0 ink=0 Rin=500Meg  ; pins IN+ IN- V+ V- OUT
R85 N044 0 100k
R86 input2 N044 100m
V9 N047 0 PULSE(0 3 0 0 0 0.4m 0.82m)
XU23 N047 N045 +5 -5 input2 level.2 Avol=1Meg GBW=10Meg Slew=10Meg ilimit=25m rail=0 Vos=0 phimargin=45 en=0 enk=0 in=0 ink=0 Rin=500Meg  ; pins IN+ IN- V+ V- OUT
R87 N045 0 100k
R88 input2 N045 100m
XU24 ctrl N003 N001 LearnOut -15 0 ctrl NC_02 N002 0 +15 ADG1236  ; pins IN1 S1A D1 S1B VSS GND IN2 S2A D2 S2B VDD
.model D D
.lib standard.dio
.model NPN NPN
.model PNP PNP
.lib standard.bjt
;tran 0 0.75 0 1000u
.tran 0.1
.lib UniversalOpamps2.sub
.lib adg1236.cir
.backanno
.end